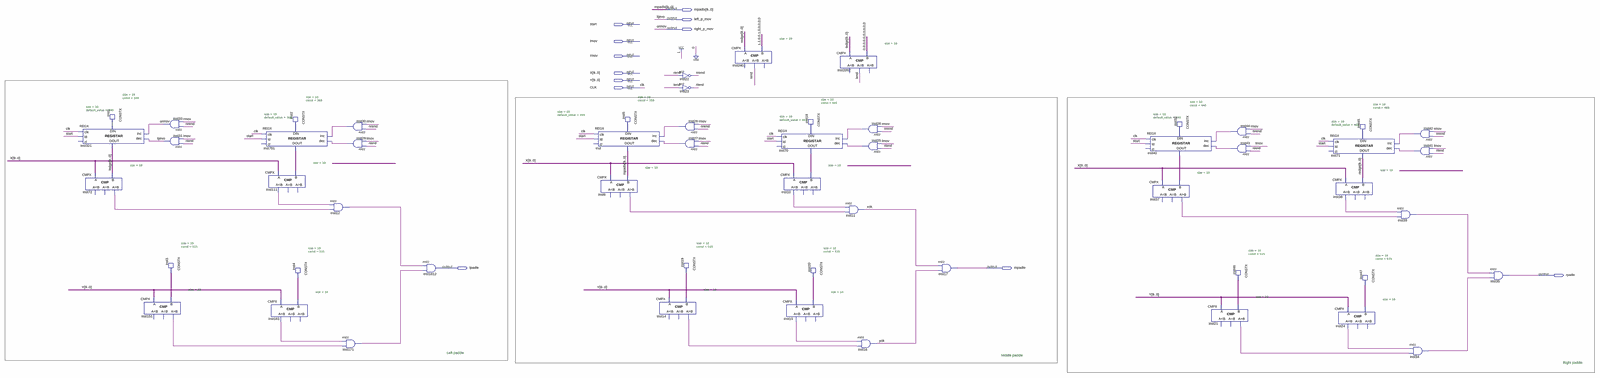
[diagram p0: schematic sheet, whole]
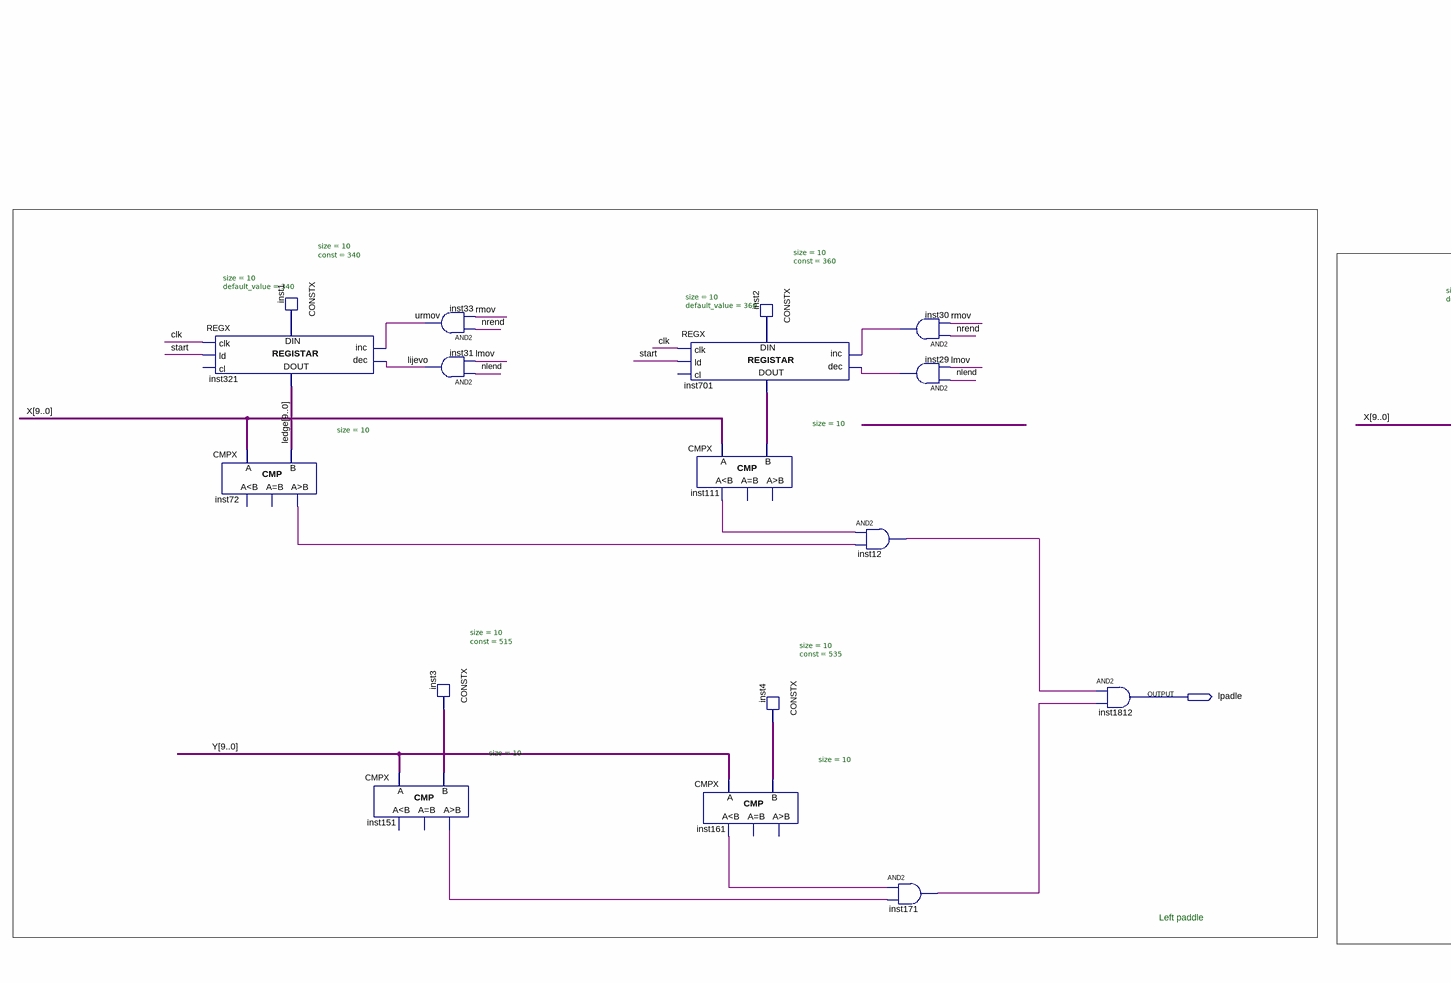
[diagram p1: schematic sheet, left part]
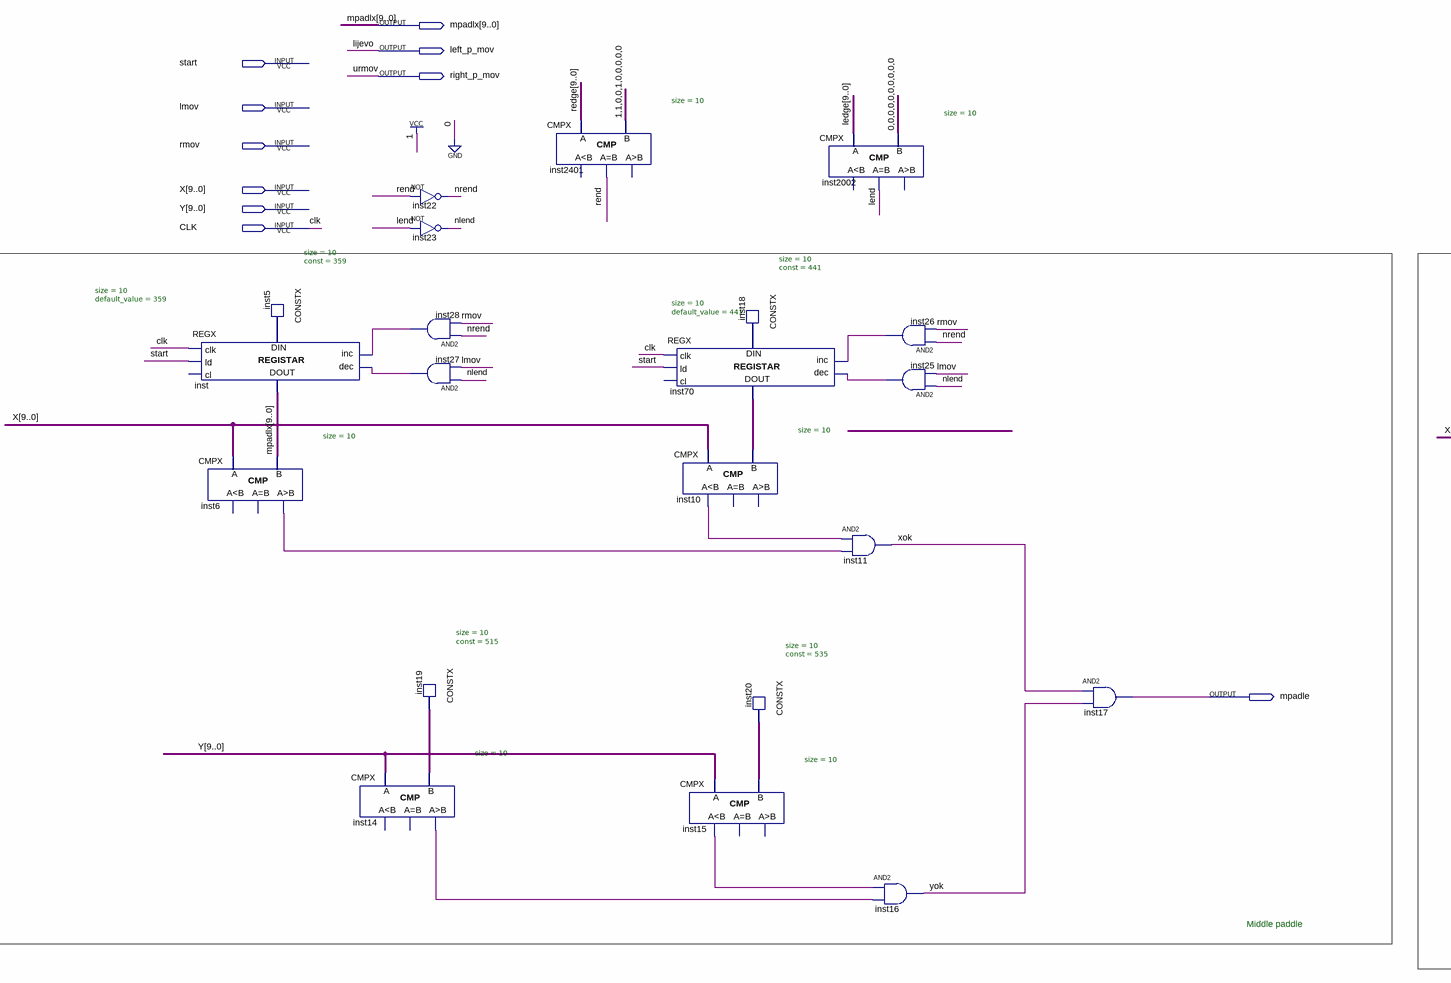
[diagram p2: schematic sheet, centre part]
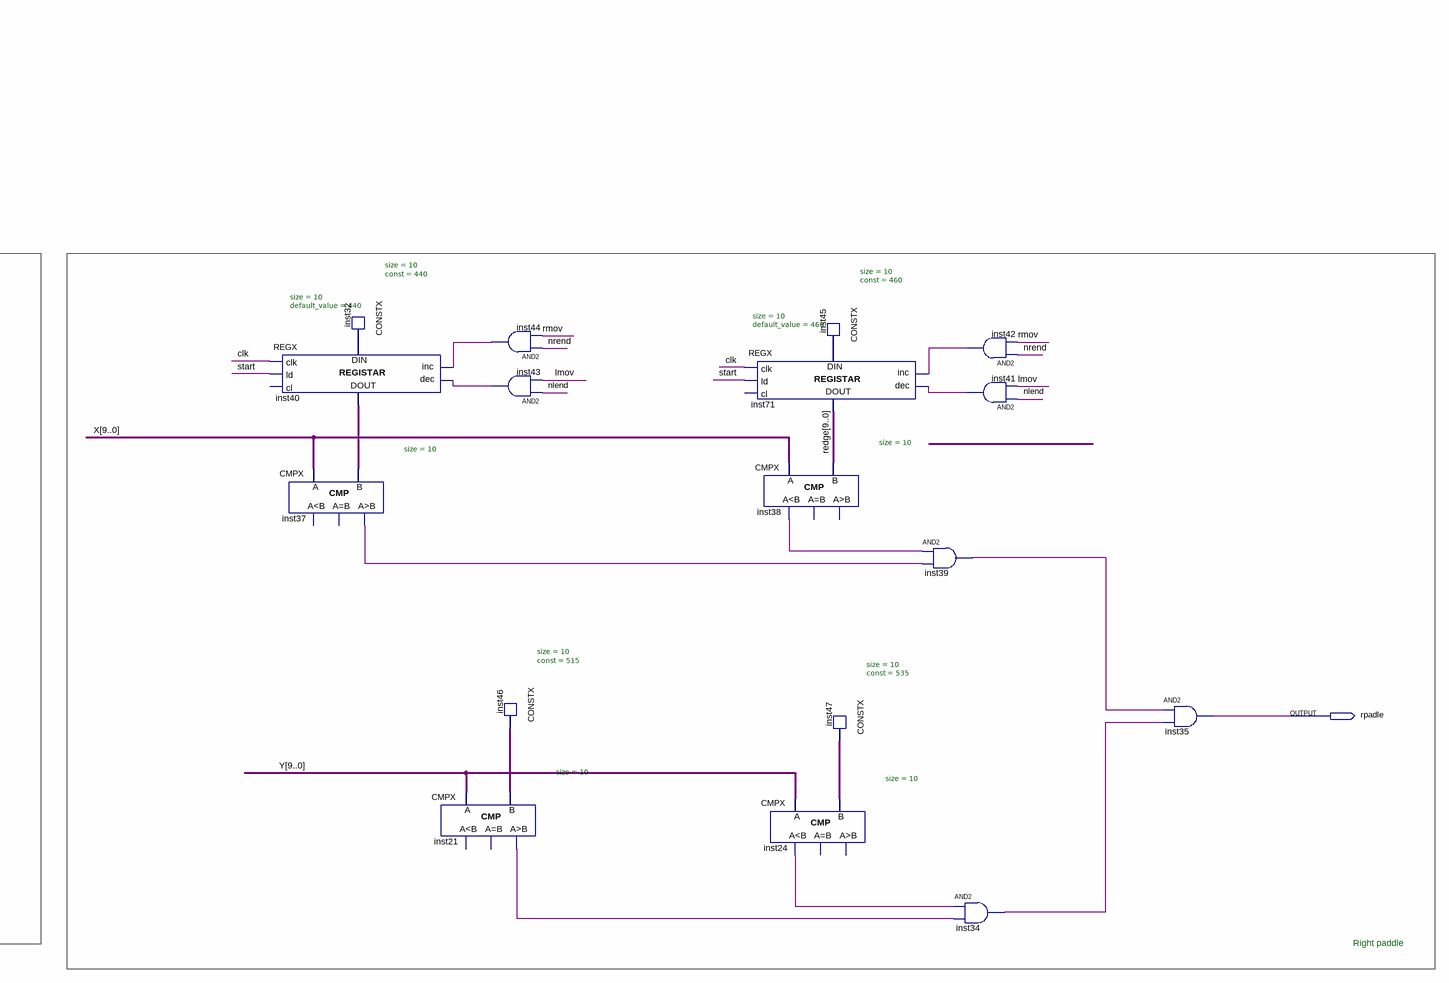
[diagram p3: schematic sheet, right part]
// Quartus schematic Padle.bdf as structural Verilog: 55 symbols, 12 pins
module Padle (
  input  start,
  input  lmov,
  input  rmov,
  input  [9:0] X,
  input  [9:0] Y,
  input  CLK,
  output [9:0] mpadlx,
  output left_p_mov,
  output right_p_mov,
  output lpadle,
  output mpadle,
  output rpadle
);

  wire inst6_gr, inst10_ls, inst12_out, inst14_gr, inst15_ls, inst21_gr, inst24_ls, inst25_out, inst26_out,
       inst27_out, inst28_out, inst29_out, inst30_out, inst34_out, inst37_gr, inst38_ls, inst39_out,
       inst41_out, inst42_out, inst43_out, inst44_out, inst72_gr, inst111_ls, inst151_gr, inst161_ls,
       inst171_out, lend, nlend, nrend, rend, xok, yok;
  wire [9:0] inst1_data, inst2_data, inst3_data, inst4_data, inst5_data, inst18_data, inst19_data,
       inst20_data, inst32_data, inst40_data_out, inst45_data, inst46_data, inst47_data, inst70_data_out,
       inst701_data_out, ledge, redge;

  REGX #(.size(10), .default_value(340)) inst321 (
    .clk(CLK), .ld(start), .inc(right_p_mov), .dec(left_p_mov), .data_in(inst1_data), .data_out(ledge));  // open: cl
  CMPX #(.size(10)) inst72 (.A(X), .B(ledge), .gr(inst72_gr));  // open: ls, eq
  CONSTX #(.size(10), .\const (340)) inst1 (.data(inst1_data));
  CMPX #(.size(10)) inst151 (.A(Y), .B(inst3_data), .gr(inst151_gr));  // open: ls, eq
  and inst33 (right_p_mov, nrend, rmov);
  and inst31 (left_p_mov, nlend, lmov);
  CONSTX #(.size(10), .\const (515)) inst3 (.data(inst3_data));
  REGX #(.size(10), .default_value(360)) inst701 (
    .clk(CLK), .ld(start), .inc(inst30_out), .dec(inst29_out), .data_in(inst2_data),
    .data_out(inst701_data_out));  // open: cl
  CMPX #(.size(10)) inst111 (.A(X), .B(inst701_data_out), .ls(inst111_ls));  // open: eq, gr
  CMPX #(.size(10)) inst161 (.A(Y), .B(inst4_data), .ls(inst161_ls));  // open: eq, gr
  CONSTX #(.size(10), .\const (360)) inst2 (.data(inst2_data));
  CONSTX #(.size(10), .\const (535)) inst4 (.data(inst4_data));
  and inst30 (inst30_out, nrend, rmov);
  and inst29 (inst29_out, nlend, lmov);
  and inst12 (inst12_out, inst111_ls, inst72_gr);
  and inst171 (inst171_out, inst161_ls, inst151_gr);
  and inst1812 (lpadle, inst12_out, inst171_out);
  REGX #(.size(10), .default_value(359)) inst (
    .clk(CLK), .ld(start), .inc(inst28_out), .dec(inst27_out), .data_in(inst5_data), .data_out(mpadlx));  // open: cl
  CMPX #(.size(10)) inst6 (.A(X), .B(mpadlx), .gr(inst6_gr));  // open: ls, eq
  CONSTX #(.size(10), .\const (359)) inst5 (.data(inst5_data));
  CMPX #(.size(10)) inst14 (.A(Y), .B(inst19_data), .gr(inst14_gr));  // open: ls, eq
  not inst22 (nrend, rend);
  not inst23 (nlend, lend);
  and inst28 (inst28_out, nrend, rmov);
  and inst27 (inst27_out, nlend, lmov);
  CONSTX #(.size(10), .\const (515)) inst19 (.data(inst19_data));
  CMPX #(.size(10)) inst2401 (.A(redge), .B(10'b1100100000), .eq(rend));  // open: ls, gr
  REGX #(.size(10), .default_value(441)) inst70 (
    .clk(CLK), .ld(start), .inc(inst26_out), .dec(inst25_out), .data_in(inst18_data),
    .data_out(inst70_data_out));  // open: cl
  CMPX #(.size(10)) inst10 (.A(X), .B(inst70_data_out), .ls(inst10_ls));  // open: eq, gr
  CMPX #(.size(10)) inst15 (.A(Y), .B(inst20_data), .ls(inst15_ls));  // open: eq, gr
  CONSTX #(.size(10), .\const (441)) inst18 (.data(inst18_data));
  CONSTX #(.size(10), .\const (535)) inst20 (.data(inst20_data));
  CMPX #(.size(10)) inst2002 (.A(ledge), .B({10{1'b0}}), .eq(lend));  // open: ls, gr
  and inst11 (xok, inst10_ls, inst6_gr);
  and inst26 (inst26_out, nrend, rmov);
  and inst25 (inst25_out, nlend, lmov);
  and inst16 (yok, inst15_ls, inst14_gr);
  and inst17 (mpadle, xok, yok);
  REGX #(.size(10), .default_value(440)) inst40 (
    .clk(CLK), .ld(start), .inc(inst44_out), .dec(inst43_out), .data_in(inst32_data),
    .data_out(inst40_data_out));  // open: cl
  CMPX #(.size(10)) inst37 (.A(X), .B(inst40_data_out), .gr(inst37_gr));  // open: ls, eq
  CONSTX #(.size(10), .\const (440)) inst32 (.data(inst32_data));
  CMPX #(.size(10)) inst21 (.A(Y), .B(inst46_data), .gr(inst21_gr));  // open: ls, eq
  and inst44 (inst44_out, nrend, rmov);
  and inst43 (inst43_out, nlend, lmov);
  CONSTX #(.size(10), .\const (515)) inst46 (.data(inst46_data));
  REGX #(.size(10), .default_value(460)) inst71 (
    .clk(CLK), .ld(start), .inc(inst42_out), .dec(inst41_out), .data_in(inst45_data), .data_out(redge));  // open: cl
  CMPX #(.size(10)) inst38 (.A(X), .B(redge), .ls(inst38_ls));  // open: eq, gr
  CMPX #(.size(10)) inst24 (.A(Y), .B(inst47_data), .ls(inst24_ls));  // open: eq, gr
  CONSTX #(.size(10), .\const (460)) inst45 (.data(inst45_data));
  CONSTX #(.size(10), .\const (535)) inst47 (.data(inst47_data));
  and inst39 (inst39_out, inst38_ls, inst37_gr);
  and inst42 (inst42_out, nrend, rmov);
  and inst41 (inst41_out, nlend, lmov);
  and inst34 (inst34_out, inst24_ls, inst21_gr);
  and inst35 (rpadle, inst39_out, inst34_out);

  // Other names for the same wires on the sheet: lijevo = left_p_mov; urmov = right_p_mov

  // Notes on the sheet:
  //   Left paddle
  //   Middle paddle
  //   Right paddle
endmodule
